# Altium project foxbms2-master.PrjPcb (part 2 of 8)

## Sheet connectors-external.SchDoc
size A3; DocumentNumber: 11; SheetNumber: 11; SheetTotal: 45; SheetDescription: Connectors (external)
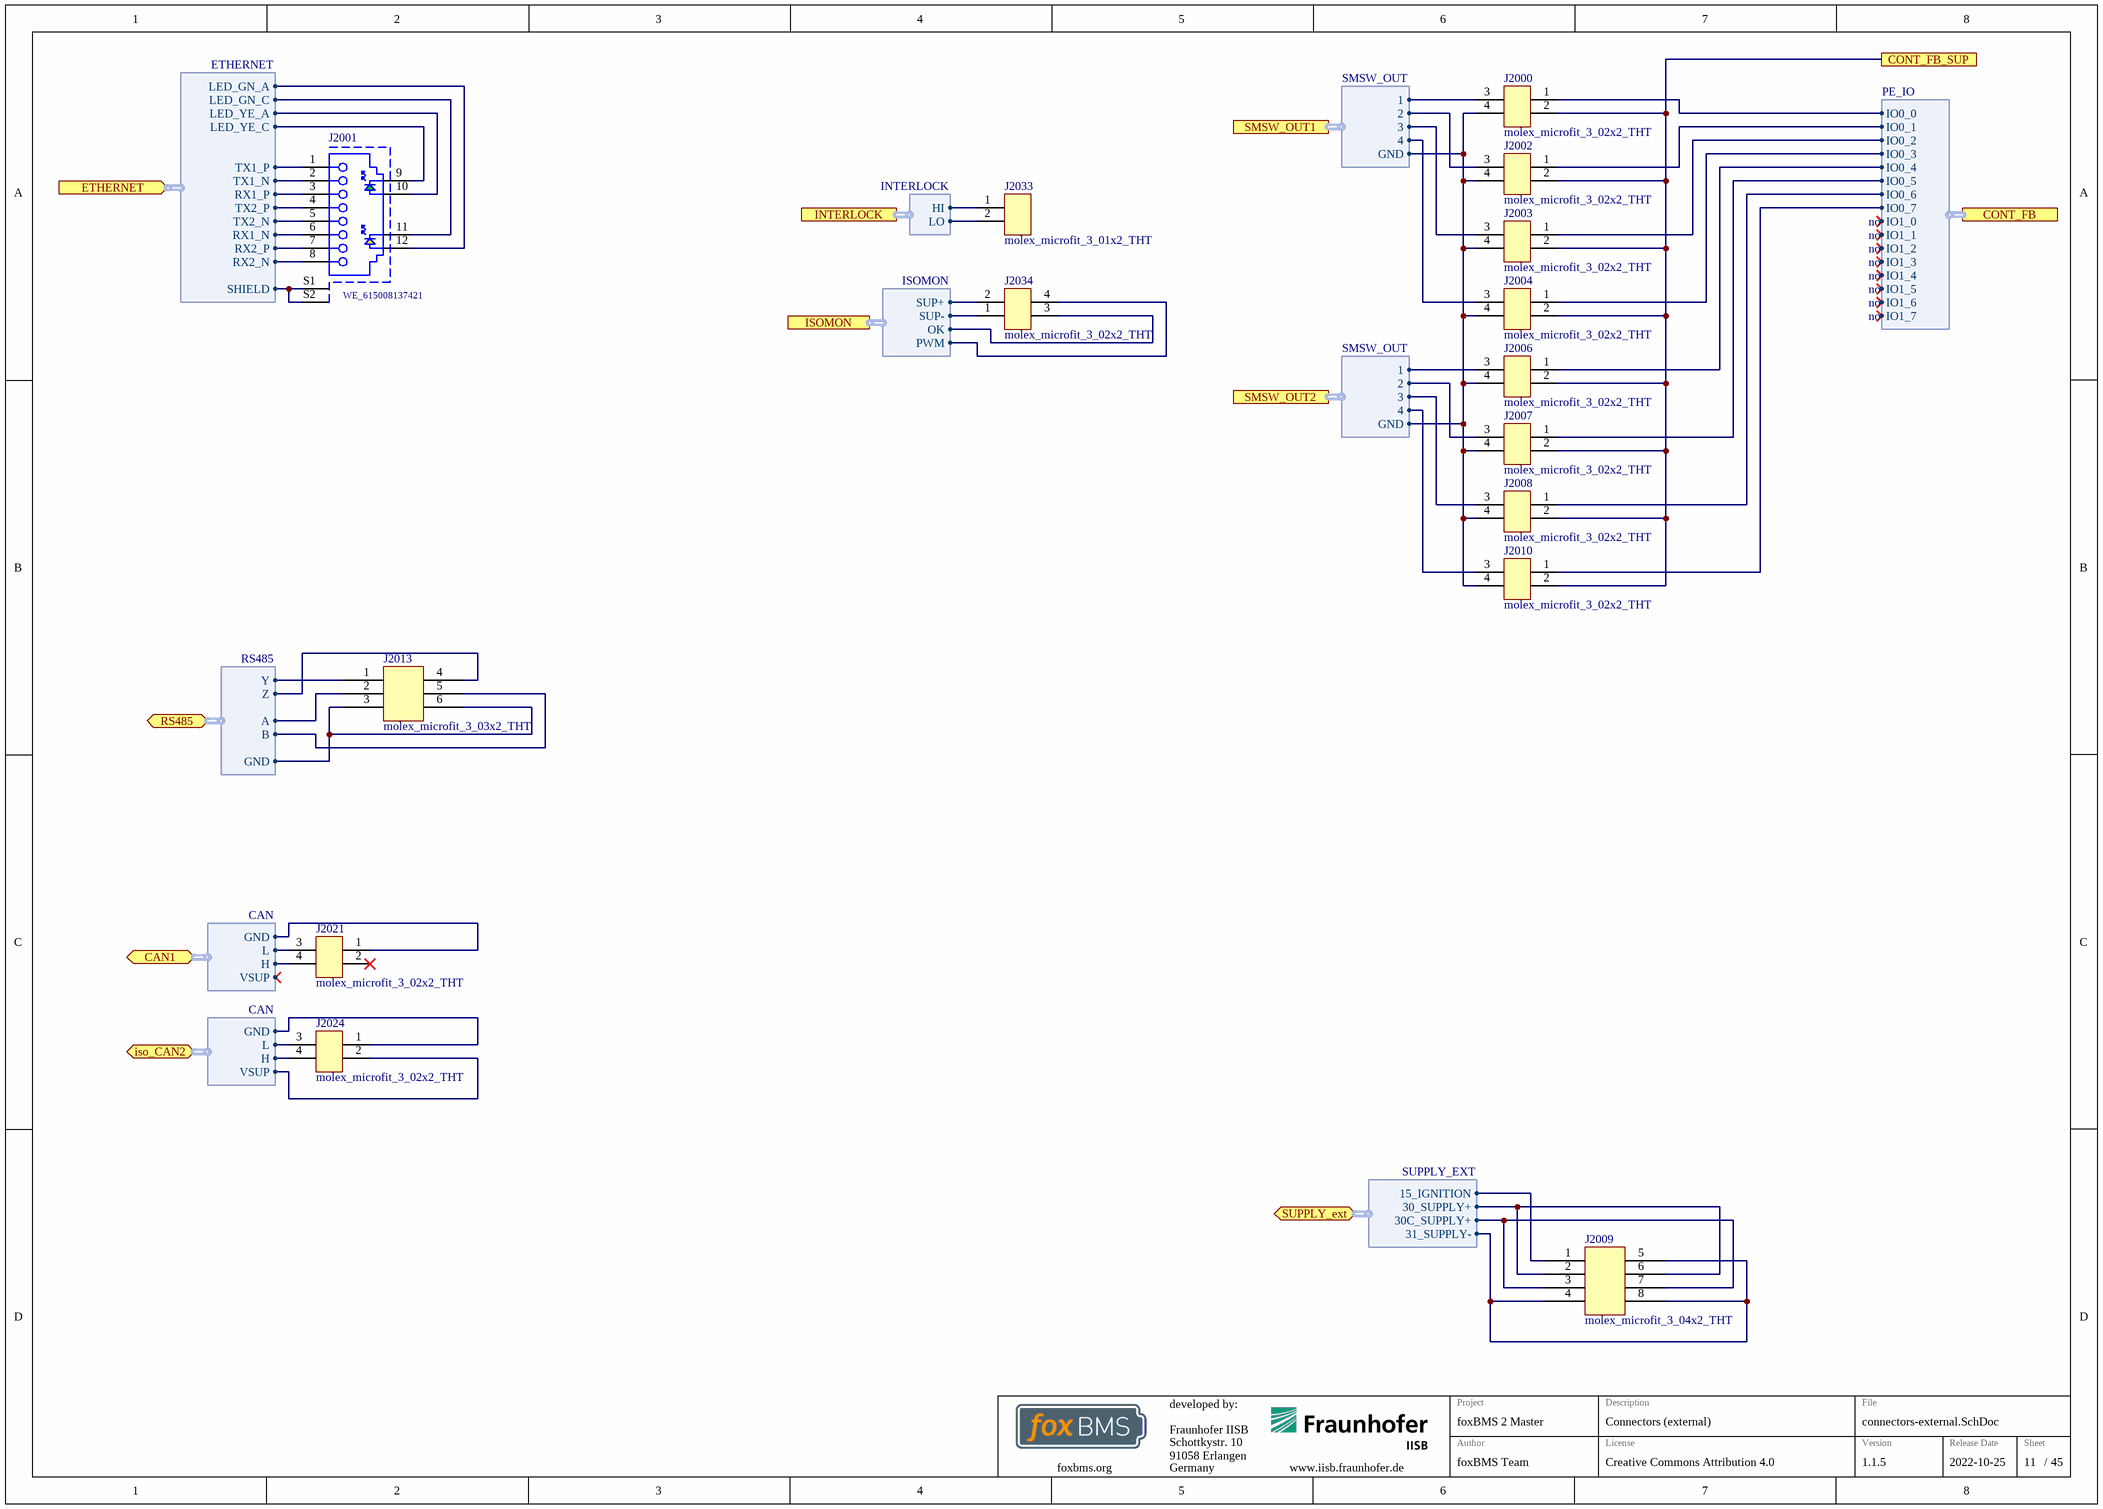
[diagram p7: connectors-external.SchDoc]

### Parts
J2000  molex_microfit_3_02x2_THT  [MOLEX_MICROFIT_02x2_THT]
J2001  WE_615008137421  [WE_615008137421]
J2002  molex_microfit_3_02x2_THT  [MOLEX_MICROFIT_02x2_THT]
J2003  molex_microfit_3_02x2_THT  [MOLEX_MICROFIT_02x2_THT]
J2004  molex_microfit_3_02x2_THT  [MOLEX_MICROFIT_02x2_THT]
J2006  molex_microfit_3_02x2_THT  [MOLEX_MICROFIT_02x2_THT]
J2007  molex_microfit_3_02x2_THT  [MOLEX_MICROFIT_02x2_THT]
J2008  molex_microfit_3_02x2_THT  [MOLEX_MICROFIT_02x2_THT]
J2009  molex_microfit_3_04x2_THT  [MOLEX_MICROFIT_04x2_THT]
J2010  molex_microfit_3_02x2_THT  [MOLEX_MICROFIT_02x2_THT]
J2013  molex_microfit_3_03x2_THT  [MOLEX_MICROFIT_03x2_THT]
J2021  molex_microfit_3_02x2_THT  [MOLEX_MICROFIT_02x2_THT]
J2024  molex_microfit_3_02x2_THT  [MOLEX_MICROFIT_02x2_THT]
J2033  molex_microfit_3_01x2_THT  [MOLEX_MICROFIT_01x2_THT]
J2034  molex_microfit_3_02x2_THT  [MOLEX_MICROFIT_02x2_THT]

### Ports
CAN1 (bidir, harness CAN), CONT_FB (harness PE_IO), CONT_FB_SUP, ETHERNET (in, harness ETHERNET), INTERLOCK (harness INTERLOCK), iso_CAN2 (bidir, harness CAN), ISOMON (harness ISOMON), RS485 (bidir, harness RS485), SMSW_OUT1 (harness SMSW_OUT), SMSW_OUT2 (harness SMSW_OUT), SUPPLY_ext (bidir, harness SUPPLY_EXT)

### Harnesses
RS485: Y, Z, A, B, GND
SMSW_OUT: 1, 2, 3, 4, GND
PE_IO: IO0_0, IO0_1, IO0_2, IO0_3, IO0_4, IO0_5, IO0_6, IO0_7, IO1_0, IO1_1, IO1_2, IO1_3, IO1_4, IO1_5, IO1_6, IO1_7
ISOMON: SUP+, SUP-, OK, PWM
CAN: H, L, GND, VSUP
INTERLOCK: HI, LO
ETHERNET: TX1_P, TX1_N, RX1_P, TX2_P, TX2_N, RX1_N, RX2_P, RX2_N, SHIELD, LED_YE_C, LED_YE_A, LED_GN_C, LED_GN_A
SUPPLY_EXT: 30_SUPPLY+, 31_SUPPLY-, 15_IGNITION, 30C_SUPPLY+

### Nets
GND: J2000.4 J2002.4 J2003.4 J2004.4 J2006.4 J2007.4 J2008.4 J2009.4 J2009.5 J2009.8 J2010.4 J2013.3 J2013.6 J2021.1 ; port RS485.GND, port SMSW_OUT1.GND, port SMSW_OUT2.GND, port CAN1.GND, port SUPPLY_ext.31_SUPPLY-
GND_ext: J2024.1 ; port iso_CAN2.GND
VBB_12V: J2000.2 J2002.2 J2003.2 J2004.2 J2006.2 J2007.2 J2008.2 J2010.2 J2034.2 ; port CONT_FB_SUP, port ISOMON.SUP+
VSUP_ext: J2009.2 J2009.6 ; port SUPPLY_ext.30_SUPPLY+
VSUP_ext: J2009.3 J2009.7 ; port SUPPLY_ext.30C_SUPPLY+  [a separate net that carries the same name]
CAN1.H: J2021.4 ; port CAN1.H
CAN1.L: J2021.3 ; port CAN1.L
CONT_FB.IO0_0: J2000.1 ; port CONT_FB.IO0_0
CONT_FB.IO0_1: J2002.1 ; port CONT_FB.IO0_1
CONT_FB.IO0_2: J2003.1 ; port CONT_FB.IO0_2
CONT_FB.IO0_3: J2004.1 ; port CONT_FB.IO0_3
CONT_FB.IO0_4: J2006.1 ; port CONT_FB.IO0_4
CONT_FB.IO0_5: J2007.1 ; port CONT_FB.IO0_5
CONT_FB.IO0_6: J2008.1 ; port CONT_FB.IO0_6
CONT_FB.IO0_7: J2010.1 ; port CONT_FB.IO0_7
ETHERNET.LED_GN_A: J2001.12 ; port ETHERNET.LED_GN_A
ETHERNET.LED_GN_C: J2001.11 ; port ETHERNET.LED_GN_C
ETHERNET.LED_YE_A: J2001.10 ; port ETHERNET.LED_YE_A
ETHERNET.LED_YE_C: J2001.9 ; port ETHERNET.LED_YE_C
ETHERNET.RX1_N: J2001.6 ; port ETHERNET.RX1_N
ETHERNET.RX1_P: J2001.3 ; port ETHERNET.RX1_P
ETHERNET.RX2_N: J2001.8 ; port ETHERNET.RX2_N
ETHERNET.RX2_P: J2001.7 ; port ETHERNET.RX2_P
ETHERNET.SHIELD: J2001.S1 J2001.S2 ; port ETHERNET.SHIELD
ETHERNET.TX1_N: J2001.2 ; port ETHERNET.TX1_N
ETHERNET.TX1_P: J2001.1 ; port ETHERNET.TX1_P
ETHERNET.TX2_N: J2001.5 ; port ETHERNET.TX2_N
ETHERNET.TX2_P: J2001.4 ; port ETHERNET.TX2_P
INTERLOCK.HI: J2033.1 ; port INTERLOCK.HI
INTERLOCK.LO: J2033.2 ; port INTERLOCK.LO
iso_CAN2.H: J2024.4 ; port iso_CAN2.H
iso_CAN2.L: J2024.3 ; port iso_CAN2.L
iso_CAN2.VSUP: J2024.2 ; port iso_CAN2.VSUP
ISOMON.OK: J2034.3 ; port ISOMON.OK
ISOMON.PWM: J2034.4 ; port ISOMON.PWM
ISOMON.SUP-: J2034.1 ; port ISOMON.SUP-
RS485.A: J2013.2 ; port RS485.A
RS485.B: J2013.5 ; port RS485.B
RS485.Y: J2013.1 ; port RS485.Y
RS485.Z: J2013.4 ; port RS485.Z
SMSW_OUT1.1: J2000.3 ; port SMSW_OUT1.1
SMSW_OUT1.2: J2002.3 ; port SMSW_OUT1.2
SMSW_OUT1.3: J2003.3 ; port SMSW_OUT1.3
SMSW_OUT1.4: J2004.3 ; port SMSW_OUT1.4
SMSW_OUT2.1: J2006.3 ; port SMSW_OUT2.1
SMSW_OUT2.2: J2007.3 ; port SMSW_OUT2.2
SMSW_OUT2.3: J2008.3 ; port SMSW_OUT2.3
SMSW_OUT2.4: J2010.3 ; port SMSW_OUT2.4
SUPPLY_ext.15_IGNITION: J2009.1 ; port SUPPLY_ext.15_IGNITION

Not connected (* = marked no-connect by the designer): J2021 2*

### Notes on the sheet
- not used
- Fraunhofer IISB
- Schottkystr. 10
- developed by:
- 91058 Erlangen
- Germany
- Author
- Project
- License
- Description
- File
- Version
- Release Date
- Sheet
- foxbms.org <https://foxbms.org>
- www.iisb.fraunhofer.de <https://www.iisb.fraunhofer.de/>
- foxBMS Team
- /

### Library data of the parts
J2000 J2002-J2004 J2006-J2008 J2010 J2021 J2024 J2034 = molex_microfit_3_02x2_THT: Micro-Fit 3.0 Right Angle Header, 3.00mm Pitch, Dual Row, 4 Circuits, with Snap-in Plastic Peg PCB Lock, Tin, Glow Wire Capable, Black, 43045-0400; Manufacturer: Molex; Circuits: 4; Rated Voltage: 600V; Rated Current: 8.5A; Automotive Qualified: False; Part Number: molex_microfit_3_02x2_THT; Part Name: MicroFit; Operating Temperature: -40°C - +105°C; Supplier 1: Farnell; Supplier Part Number 1: 9733019; ECCN: EAR99
J2001 = WE_615008137421: Modular Jack WR-MJ, Tab Up; Manufacturer: Würth; Pin Number: 8P8C; Port: 1x1; Entrance: Horizontal; Compliance: Lead free / RoHS; Rated Current: 1.5 A; Working Voltage: 125 VAC; Withstanding Voltage: 1000 VAC; Contact Resistance: 30 mOhm; Circuits: 12; Rated Voltage: 120V AC; Automotive Qualified: False; ComponentLink1Description: Datasheet; ComponentLink1URL: https://www.we-online.com/katalog/datasheet/615008137421.pdf; ComponentLink2Description: Datasheet; ComponentLink2URL: https://katalog.we-online.de/em/datasheet/615008185121.pdf; Part Number: WE_615008137421; Published Date: July 2018; Publisher: Wurth Elektronik; Operating Temperature: −40 °C - +85 °C; Mounting Technology: THT; Packaging: Tray; Part Name: WE_615008137421; Supplier 1: Mouser; Supplier Part Number 1: 710-615008137421; Supplier 3: Wuerth Electronics; Supplier Part Number 3: 615008137421; ECCN: EAR99
J2009 = molex_microfit_3_04x2_THT: Micro-Fit 3.0 Right Angle Header, 3.00mm Pitch, Dual Row, 8 Circuits, with Snap-in Plastic Peg PCB Lock, Tin, Glow Wire Capable, Black, 43045-0800; Manufacturer: Molex; Circuits: 8; Rated Voltage: 600V; Rated Current: 8.5A; Automotive Qualified: False; Part Number: molex_microfit_3_04x2_THT; Part Name: MicroFit; Operating Temperature: -40°C - +105°C; Supplier 1: Farnell; Supplier Part Number 1: 1012254; ECCN: EAR99
J2013 = molex_microfit_3_03x2_THT: Micro-Fit 3.0 Right Angle Header, 3.00mm Pitch, Dual Row, 6 Circuits, with Snap-in Plastic Peg PCB Lock, Tin, Glow Wire Capable, Black, 43045-0600; Manufacturer: Molex; Circuits: 6; Rated Voltage: 600V; Rated Current: 8.5A; Automotive Qualified: False; Part Number: molex_microfit_3_03x2_THT; Part Name: MicroFit; Operating Temperature: -40°C - +105°C; Supplier 1: Farnell; Supplier Part Number 1: 1012252; ECCN: EAR99
J2033 = molex_microfit_3_01x2_THT: Micro-Fit 3.0 Right Angle Header, 3.00mm Pitch, Dual Row, 2 Circuits, with Snap-in Plastic Peg PCB Lock, Tin, Glow Wire Capable, Black, 43045-0200; Manufacturer: Molex; Circuits: 2; Rated Voltage: 600V; Rated Current: 8.5A; Automotive Qualified: False; Part Number: molex_microfit_3_01x2_THT; Part Name: MicroFit; Operating Temperature: -40°C - +105°C; Supplier 1: Farnell; Supplier Part Number 1: 1012251; ECCN: EAR99

## Sheet connectors-internal.SchDoc
size A3; DocumentNumber: 13; SheetNumber: 13; SheetTotal: 45; SheetDescription: Connectors (internal)
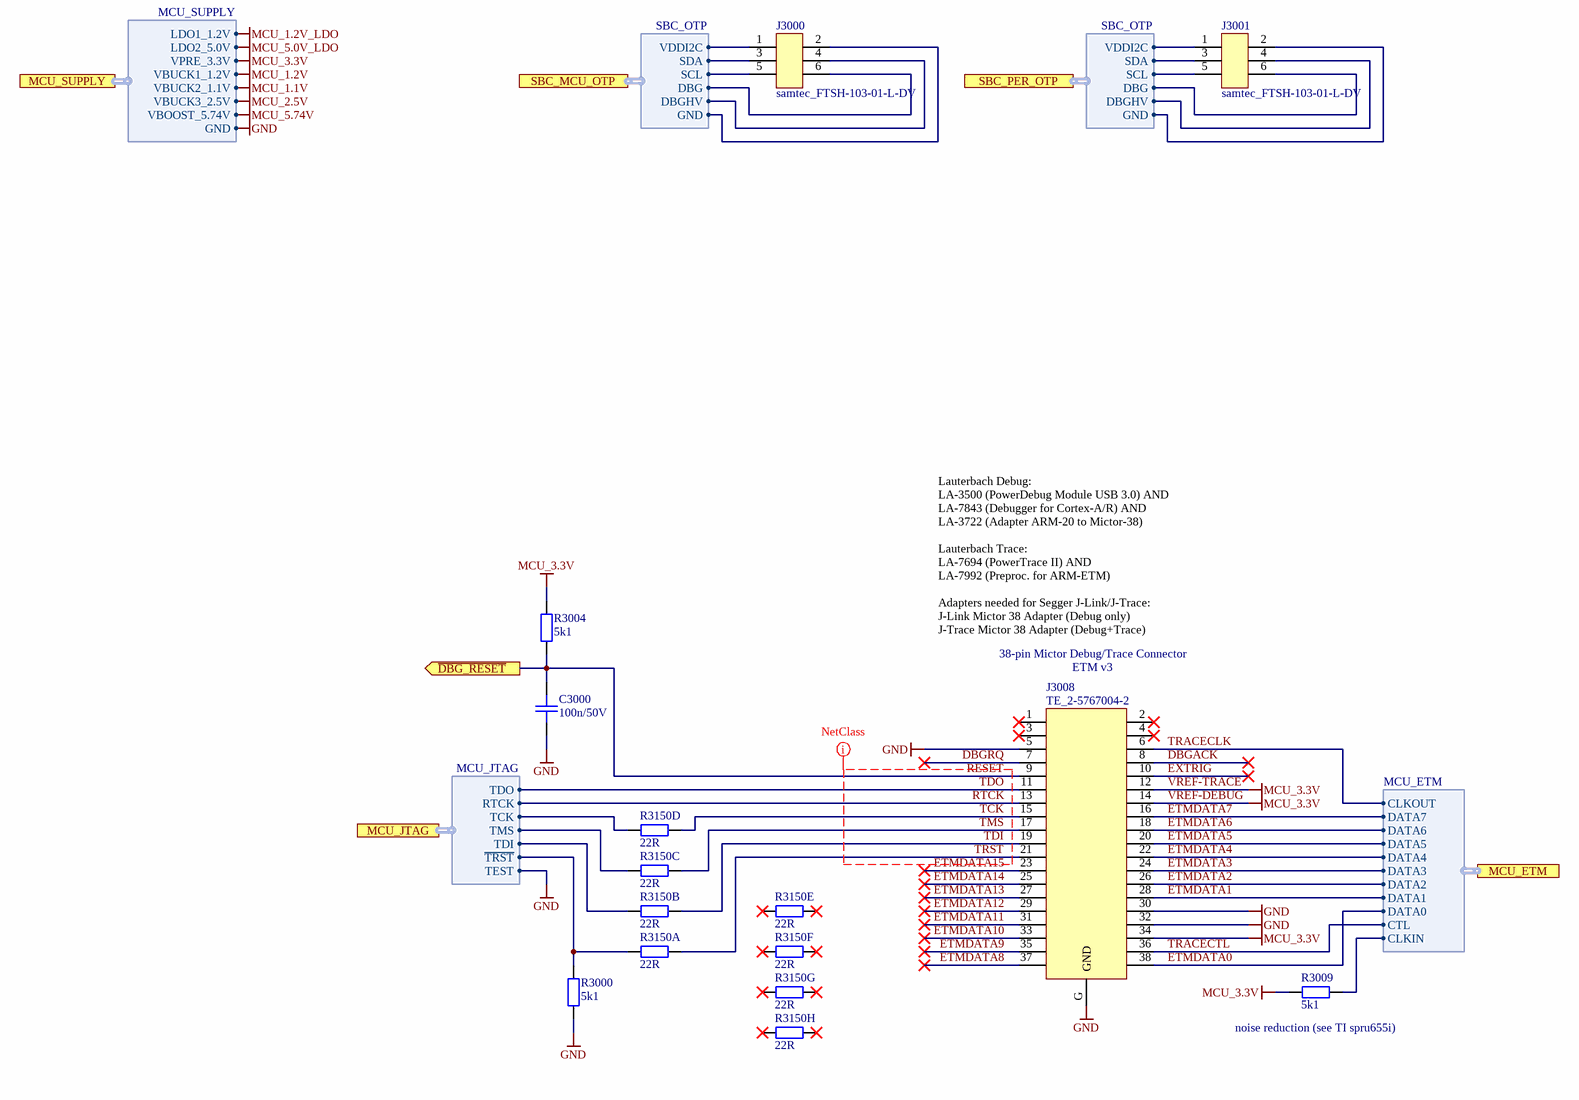
[diagram p8: connectors-internal.SchDoc]

### Parts
C3000  100n/50V  [CAPC1005X06N]
J3000  samtec_FTSH-103-01-L-DV  [SAMTEC_FTSH-103-01-L-DV]
J3001  samtec_FTSH-103-01-L-DV  [SAMTEC_FTSH-103-01-L-DV]
J3008  TE_2-5767004-2  [TE_2-5767004-2]
R3000  5k1  [RESC1005X04N]
R3004  5k1  [RESC1005X04N]
R3009  5k1  [RESC1005X04N]
R3150  22R  [PANASONIC_EXB2HV]  (parts A,B,C,D,E,F,G,H of 8)

### Ports
MCU_ETM (harness MCU_ETM), MCU_JTAG (harness MCU_JTAG), MCU_SUPPLY (harness MCU_SUPPLY), SBC_MCU_OTP (harness SBC_OTP), SBC_PER_OTP (harness SBC_OTP), ~{DBG_RESET} (out)

### Harnesses
SBC_OTP: VDDI2C, SDA, SCL, GND, DBG, DBGHV
MCU_SUPPLY: VBUCK1_1.2V, VBUCK2_1.1V, VBUCK3_2.5V, LDO1_1.2V, LDO2_5.0V, GND, VPRE_3.3V, VBOOST_5.74V
MCU_ETM: CLKOUT, CTL, CLKIN, DATA0, DATA1, DATA2, DATA3, DATA4, DATA5, DATA6, DATA7
MCU_JTAG: ~{TRST}, RTCK, TCK, TDI, TDO, TMS, TEST

### Nets
GND: C3000.1 J3000.2 J3001.2 J3008.5 J3008.30 J3008.32 J3008.G(GND) R3000.1 ; port SBC_MCU_OTP.GND, port SBC_PER_OTP.GND, port MCU_SUPPLY.GND, port MCU_JTAG.TEST
MCU_3.3V: J3000.1 J3008.12 J3008.14 J3008.34 R3004.2 R3009.2 ; port SBC_MCU_OTP.VDDI2C, port MCU_SUPPLY.VPRE_3.3V  [also labelled VREF-DEBUG, VREF-TRACE]
PER_3.3V: J3001.1 ; port SBC_PER_OTP.VDDI2C
~{RESET}: C3000.2 J3008.9 R3004.1 ; port ~{DBG_RESET}  [project net ~{DBG_RESET}]
~{TRST}: J3008.21 R3150.16  [project net ~{TRST_13}]
DBGACK: J3008.8  [project net DBGACK_13]
DBGRQ: J3008.7  [project net DBGRQ_13]
ETMDATA0: J3008.38 ; port MCU_ETM.DATA0  [project net MCU_ETM.DATA0]
ETMDATA1: J3008.28 ; port MCU_ETM.DATA1  [project net MCU_ETM.DATA1]
ETMDATA2: J3008.26 ; port MCU_ETM.DATA2  [project net MCU_ETM.DATA2]
ETMDATA3: J3008.24 ; port MCU_ETM.DATA3  [project net MCU_ETM.DATA3]
ETMDATA4: J3008.22 ; port MCU_ETM.DATA4  [project net MCU_ETM.DATA4]
ETMDATA5: J3008.20 ; port MCU_ETM.DATA5  [project net MCU_ETM.DATA5]
ETMDATA6: J3008.18 ; port MCU_ETM.DATA6  [project net MCU_ETM.DATA6]
ETMDATA7: J3008.16 ; port MCU_ETM.DATA7  [project net MCU_ETM.DATA7]
ETMDATA8: J3008.37  [project net ETMDATA8_13]
ETMDATA9: J3008.35  [project net ETMDATA9_13]
ETMDATA10: J3008.33  [project net ETMDATA10_13]
ETMDATA11: J3008.31  [project net ETMDATA11_13]
ETMDATA12: J3008.29  [project net ETMDATA12_13]
ETMDATA13: J3008.27  [project net ETMDATA13_13]
ETMDATA14: J3008.25  [project net ETMDATA14_13]
ETMDATA15: J3008.23  [project net ETMDATA15_13]
EXTRIG: J3008.10  [project net EXTRIG_13]
MCU_ETM.CLKIN: R3009.1 ; port MCU_ETM.CLKIN
MCU_JTAG~{.}TRST: R3000.2 R3150.1 ; port MCU_JTAG.~{TRST}
MCU_JTAG.TCK: R3150.4 ; port MCU_JTAG.TCK
MCU_JTAG.TDI: R3150.2 ; port MCU_JTAG.TDI
MCU_JTAG.TMS: R3150.3 ; port MCU_JTAG.TMS
RTCK: J3008.13 ; port MCU_JTAG.RTCK  [project net MCU_JTAG.RTCK]
SBC_MCU_OTP.DBG: J3000.6 ; port SBC_MCU_OTP.DBG
SBC_MCU_OTP.DBGHV: J3000.4 ; port SBC_MCU_OTP.DBGHV
SBC_MCU_OTP.SCL: J3000.5 ; port SBC_MCU_OTP.SCL
SBC_MCU_OTP.SDA: J3000.3 ; port SBC_MCU_OTP.SDA
SBC_PER_OTP.DBG: J3001.6 ; port SBC_PER_OTP.DBG
SBC_PER_OTP.DBGHV: J3001.4 ; port SBC_PER_OTP.DBGHV
SBC_PER_OTP.SCL: J3001.5 ; port SBC_PER_OTP.SCL
SBC_PER_OTP.SDA: J3001.3 ; port SBC_PER_OTP.SDA
TCK: J3008.15 R3150.13  [project net TCK_13]
TDI: J3008.19 R3150.15  [project net TDI_13]
TDO: J3008.11 ; port MCU_JTAG.TDO  [project net MCU_JTAG.TDO]
TMS: J3008.17 R3150.14  [project net TMS_13]
TRACECLK: J3008.6 ; port MCU_ETM.CLKOUT  [project net MCU_ETM.CLKOUT]
TRACECTL: J3008.36 ; port MCU_ETM.CTL  [project net MCU_ETM.CTL]

Not connected (* = marked no-connect by the designer): J3008 1* 2* 3* 4*; R3150 5* 6* 7* 8* 9* 10* 11* 12*

### Layout directives
net class MCU_JTAG: RTCK, TCK, TDI, TDO, TMS, ~{RESET}, ~{TRST}

### Notes on the sheet
- Lauterbach Debug:
  LA-3500 (PowerDebug Module USB 3.0) AND
  LA-7843 (Debugger for Cortex-A/R) AND
  LA-3722	(Adapter ARM-20 to Mictor-38)
  Lauterbach Trace:
  LA-7694 (PowerTrace II) AND
  LA-7992 (Preproc. for ARM-ETM)
  Adapters needed for Segger J-Link/J-Trace:
  J-Link Mictor 38 Adapter (Debug only)
  J-Trace Mictor 38 Adapter (Debug+Trace)
- 38-pin Mictor Debug/Trace Connector
- (near J3008) ETM v3
- (near R3009) noise reduction (see TI spru655i)
- Fraunhofer IISB
- Schottkystr. 10
- developed by:
- 91058 Erlangen
- Germany
- Author
- Project
- License
- Description
- File
- Version
- Release Date
- Sheet
- foxbms.org <https://foxbms.org>
- www.iisb.fraunhofer.de <https://www.iisb.fraunhofer.de/>
- foxBMS Team
- /

### Library data of the parts
C3000 = gen_C_ceramic_100n_50V_X7R_0402: MLCC; Capacitance: 100n; Rated Voltage: 50V; Dielectric: X7R; Case EIA: 0402; Case Metric: 1005; PnP Package: 0402C; PnP Value: 100nF/50V/X7R; PnP equipped: x; Automotive Qualified: True; AEC-Q Norm: AEC-Q200; Part Number: gen_C_ceramic_100n_50V_X7R_0402; Supplier 1: Farnell; Supplier Part Number 1: 2210822; ECCN: EAR99
J3000 J3001 = samtec_FTSH-103-01-L-DV: Board-To-Board Connector, 6pin, 1.27mm; Manufacturer: Samtec; Circuits: 6; Rated Current: 3.4A; Automotive Qualified: False; Part Number: samtec_FTSH-103-01-L-DV; Part Name: FTSH-103-01-L-DV; Operating Temperature: -55°C - +125°C; ComponentLink1Description: Datasheet; ComponentLink1URL: http://www.farnell.com/datasheets/1992056.pdf; Supplier 1: Farnell; Supplier Part Number 1: 2415840; Supplier 2: Mouser; Supplier Part Number 2: 200-FTSH10301LDVTR; Supplier 3: Digikey; Supplier Part Number 3: SAM13920CT-ND
J3008 = TE_2-5767004-2: Connector, SMT, 38 POS, MICTOR; Manufacturer: TE; Circuits: 38; Rated Voltage: 30V AC; Rated Current: 11.5A; Automotive Qualified: False; Part Number: TE_2-5767004-2; Part Name: TE_2-5767004-2; Operating Temperature: −55 °C - +125 °C; ComponentLink1Description: Datasheet; ComponentLink1URL: https://www.te.com/deu-de/product-2-5767004-2.datasheet.pdf; Supplier 1: Mouser; Supplier Part Number 1: 571-2-5767004-2; Supplier 2: Farnell; Supplier Part Number 2: 1076633; Supplier 3: Digikey; Supplier Part Number 3: A32308-ND; ECCN: EAR99
R3000 R3004 R3009 = gen_R_5k1_0402: SMD Resistor 5k1 0402; Tolerance: 1%; Power: 0.063W; Case EIA: 0402; Case Metric: 1005; Maximum Working Voltage: 50V; PnP Package: 0402R; Automotive Qualified: True; PnP equipped: x; AEC-Q Norm: AEC-Q200; AEC-Q Grade: Grade 0; Part Number: gen_R_5k1_0402; Operating Temperature: -55°C - +155°C; Resistance: 5k1; Series: E24; PnP Value: 5k1; Supplier 1: Farnell; Supplier Part Number 1: 2302709; ECCN: EAR99
R3150 = EXB2HV220JV: SMD Resistor Array 0402 8x; Tolerance: 5%; Power: 63mW; Case EIA: EXB2HV; Maximum Working Voltage: 25V; Automotive Qualified: True; AEC-Q Norm: AEC-Q200; AEC-Q Grade: Grade 1; Part Number: EXB2HV220JV; Operating Temperature: -55°C - +155°C; Resistance: 22R; Series: E24, E96; Supplier 1: Farnell; Supplier Part Number 1: 2060065; Supplier 2: Mouser; Supplier Part Number 2: 667-EXB-2HV220JV; ECCN: EAR99

## Sheet communication.SchDoc
size A3; DocumentNumber: 2; SheetNumber: 2; SheetTotal: 45; SheetDescription: Communication
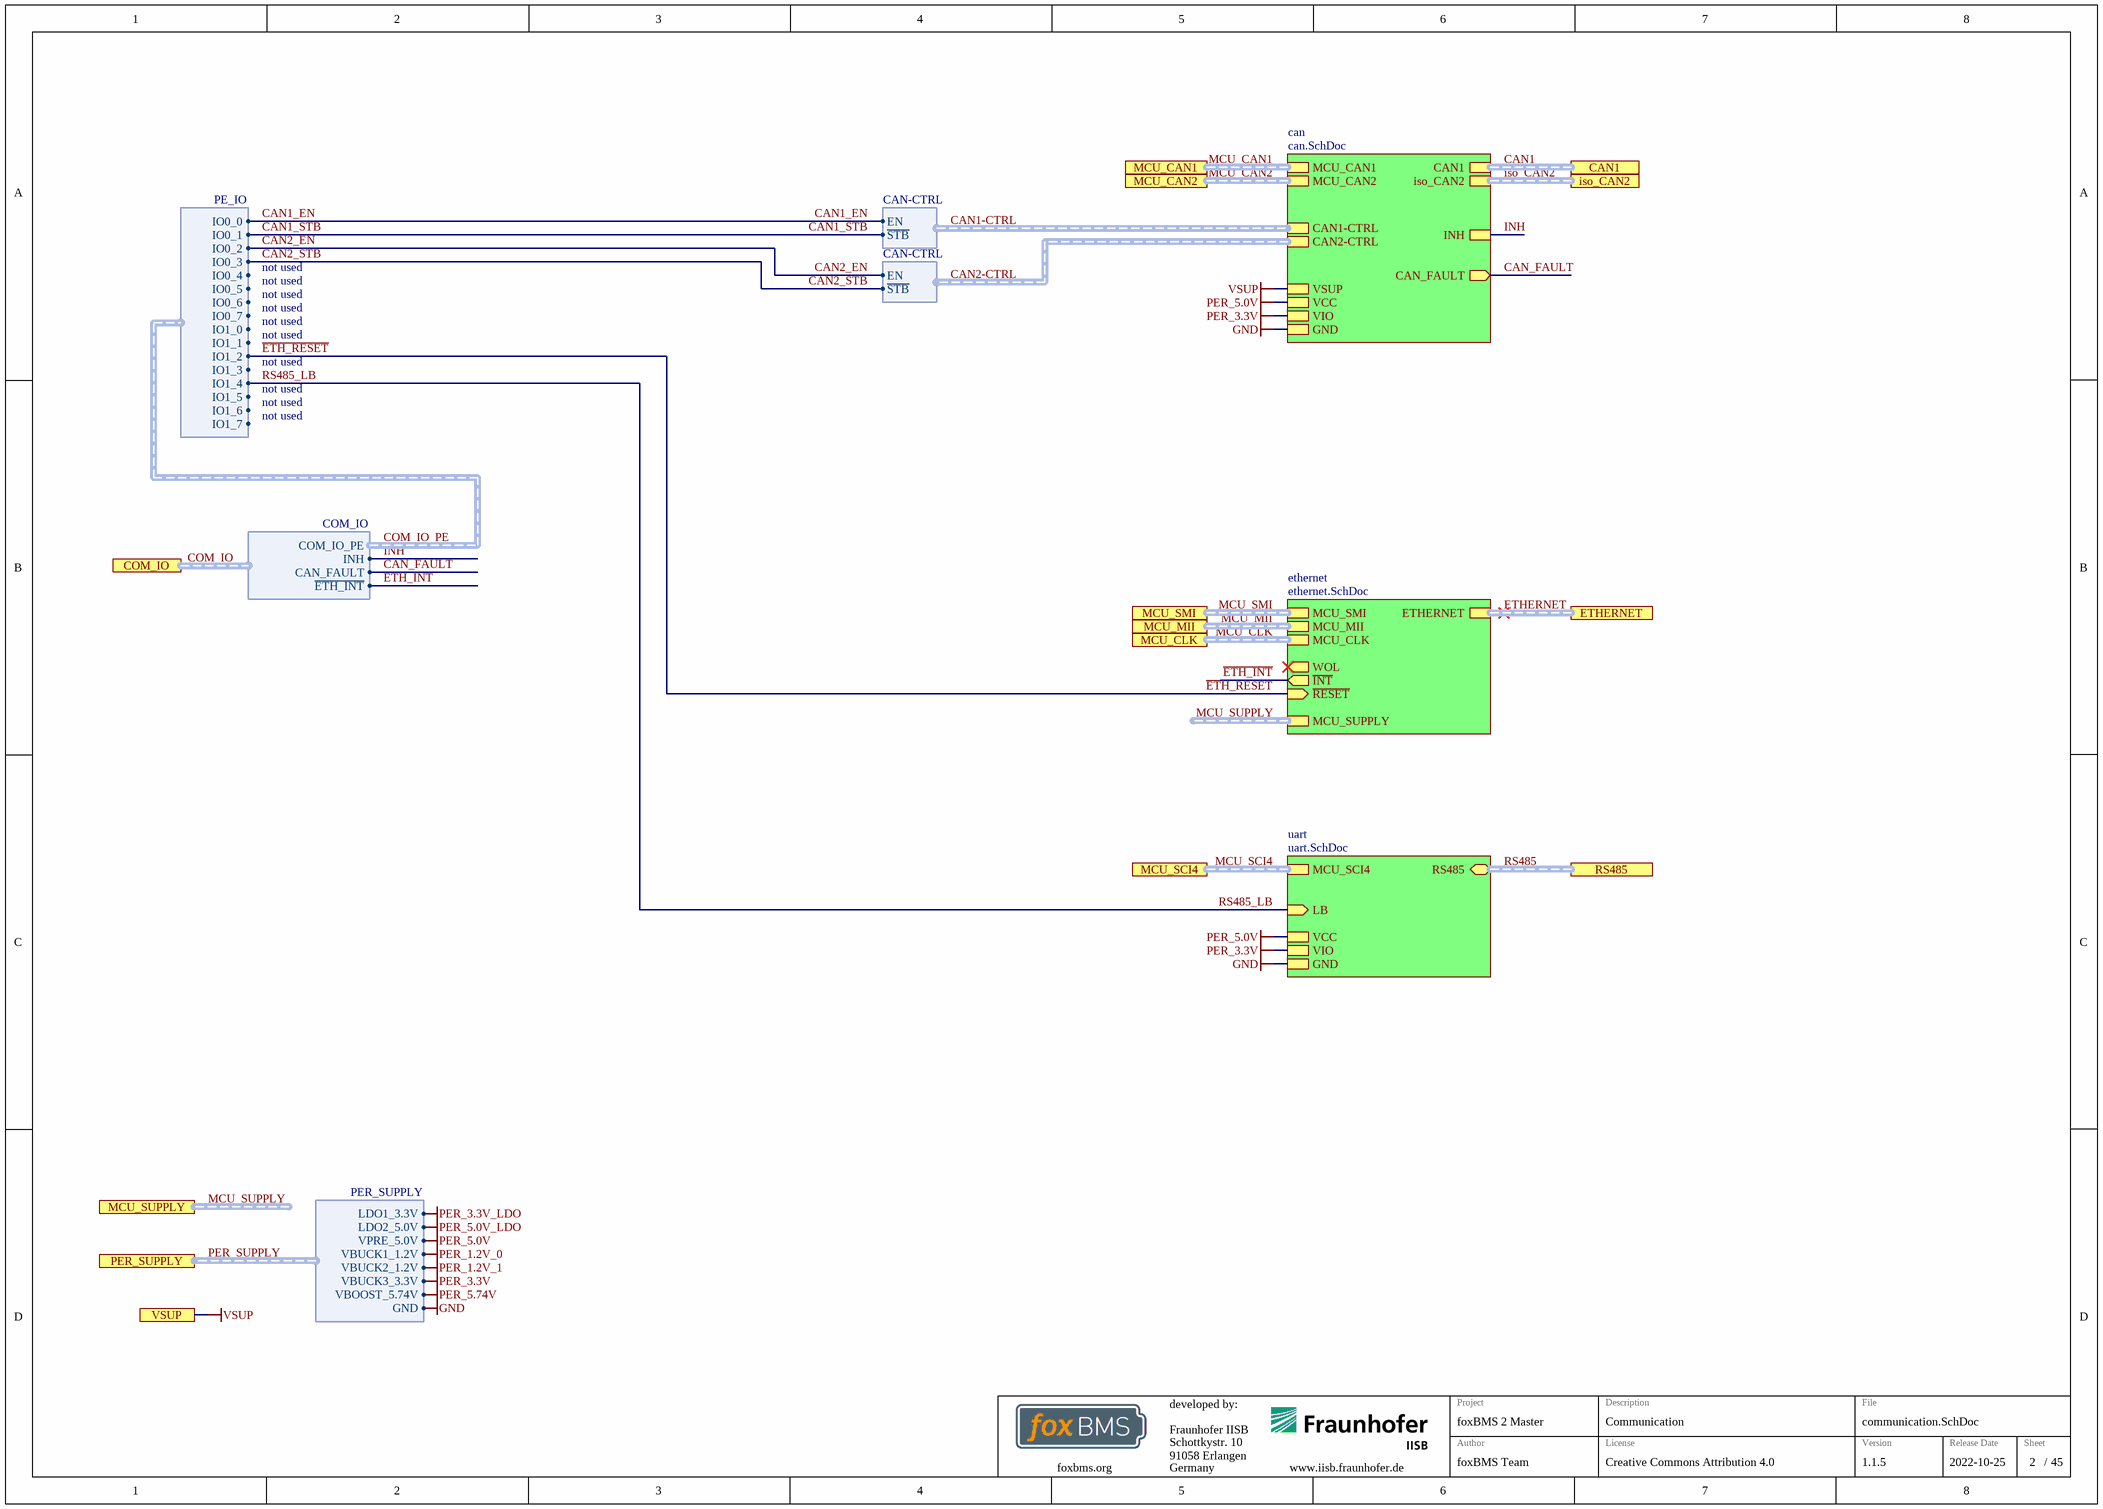
[diagram p9: communication.SchDoc]

### Sub-sheets
can = can.SchDoc: MCU_CAN1 (harness MCU_CAN), CAN2-CTRL (harness CAN-CTRL), CAN1-CTRL (harness CAN-CTRL), MCU_CAN2 (harness MCU_CAN), iso_CAN2 (harness CAN), CAN1 (harness CAN), VCC, GND, VSUP, INH, CAN_FAULT (out), VIO
ethernet = ethernet.SchDoc: MCU_SMI (harness MCU_SMI), WOL (out), MCU_MII (harness MCU_MII), ~{INT} (out), ~{RESET} (in), ETHERNET (harness ETHERNET), MCU_SUPPLY (harness MCU_SUPPLY), MCU_CLK (harness CLOCK)
uart = uart.SchDoc: MCU_SCI4 (harness MCU_SCI), LB (in), VIO, RS485 (bidir, harness RS485), VCC, GND

### Ports
CAN1 (harness CAN), COM_IO (harness COM_IO), ETHERNET (harness ETHERNET), iso_CAN2 (harness CAN), MCU_CAN1 (harness MCU_CAN), MCU_CAN2 (harness MCU_CAN), MCU_CLK (harness CLOCK), MCU_MII (harness MCU_MII), MCU_SCI4 (harness MCU_SCI), MCU_SMI (harness MCU_SMI), MCU_SUPPLY (harness MCU_SUPPLY), PER_SUPPLY (harness PER_SUPPLY), RS485 (harness RS485), VSUP

### Harnesses
PE_IO: IO0_0, IO0_1, IO0_2, IO0_3, IO0_4, IO0_5, IO0_6, IO0_7, IO1_0, IO1_1, IO1_2, IO1_3, IO1_4, IO1_5, IO1_6, IO1_7
CAN-CTRL: EN, ~{STB}
PER_SUPPLY: GND, VBOOST_5.74V, LDO1_3.3V, LDO2_5.0V, VPRE_5.0V, VBUCK1_1.2V, VBUCK2_1.2V, VBUCK3_3.3V
COM_IO: COM_IO_PE, CAN_FAULT, ~{ETH_INT}, INH

### Nets
GND: sheet can/GND, sheet uart/GND, port PER_SUPPLY.GND
PER_3.3V: sheet can/VIO, sheet uart/VIO, port PER_SUPPLY.VBUCK3_3.3V
PER_5.0V: sheet can/VCC, sheet uart/VCC, port PER_SUPPLY.VPRE_5.0V
VSUP: port VSUP, sheet can/VSUP  [project net VSUP_30]
~{CAN1_STB}: harness PE_IO.IO0_1, sheet can/CAN1-CTRL.~{STB}  [project net CAN1-CTRL~{.}STB]
~{CAN2_STB}: harness PE_IO.IO0_3, sheet can/CAN2-CTRL.~{STB}  [project net CAN2-CTRL~{.}STB]
~{ETH_INT}: sheet ethernet/~{INT}, port COM_IO.~{ETH_INT}  [project net COM_IO~{.}ETH_INT]
~{ETH_RESET}: sheet ethernet/~{RESET}, harness PE_IO.IO1_2  [project net COM_IO_PE.IO1_2]
CAN1_EN: harness PE_IO.IO0_0, sheet can/CAN1-CTRL.EN  [project net CAN1-CTRL.EN]
CAN2_EN: harness PE_IO.IO0_2, sheet can/CAN2-CTRL.EN  [project net CAN2-CTRL.EN]
CAN_FAULT: sheet can/CAN_FAULT, port COM_IO.CAN_FAULT  [project net COM_IO.CAN_FAULT]
INH: sheet can/INH, port COM_IO.INH  [project net COM_IO.INH]
RS485_LB: sheet uart/LB, harness PE_IO.IO1_4  [project net COM_IO_PE.IO1_4]

### Buses and harness runs
harness CAN1 = port CAN1 = sheet can/CAN1
harness CAN1-CTRL = sheet can/CAN1-CTRL
harness CAN2-CTRL = sheet can/CAN2-CTRL
harness COM_IO = port COM_IO
harness ETHERNET = port ETHERNET = sheet ethernet/ETHERNET
harness iso_CAN2 = port iso_CAN2 = sheet can/iso_CAN2
harness MCU_CAN1 = port MCU_CAN1 = sheet can/MCU_CAN1
harness MCU_CAN2 = port MCU_CAN2 = sheet can/MCU_CAN2
harness MCU_CLK = port MCU_CLK = sheet ethernet/MCU_CLK
harness MCU_MII = port MCU_MII = sheet ethernet/MCU_MII
harness MCU_SCI4 = port MCU_SCI4 = sheet uart/MCU_SCI4
harness MCU_SMI = port MCU_SMI = sheet ethernet/MCU_SMI
harness MCU_SUPPLY = port MCU_SUPPLY
harness MCU_SUPPLY = sheet ethernet/MCU_SUPPLY
harness PER_SUPPLY = port PER_SUPPLY
harness RS485 = port RS485 = sheet uart/RS485

### Notes on the sheet
- not used
- Fraunhofer IISB
- Schottkystr. 10
- developed by:
- 91058 Erlangen
- Germany
- Author
- Project
- License
- Description
- File
- Version
- Release Date
- Sheet
- foxbms.org <https://foxbms.org>
- www.iisb.fraunhofer.de <https://www.iisb.fraunhofer.de/>
- foxBMS Team
- /

## Sheet can.SchDoc
size A3; DocumentNumber: 3; SheetNumber: 3; SheetTotal: 45; SheetDescription: CAN Communication
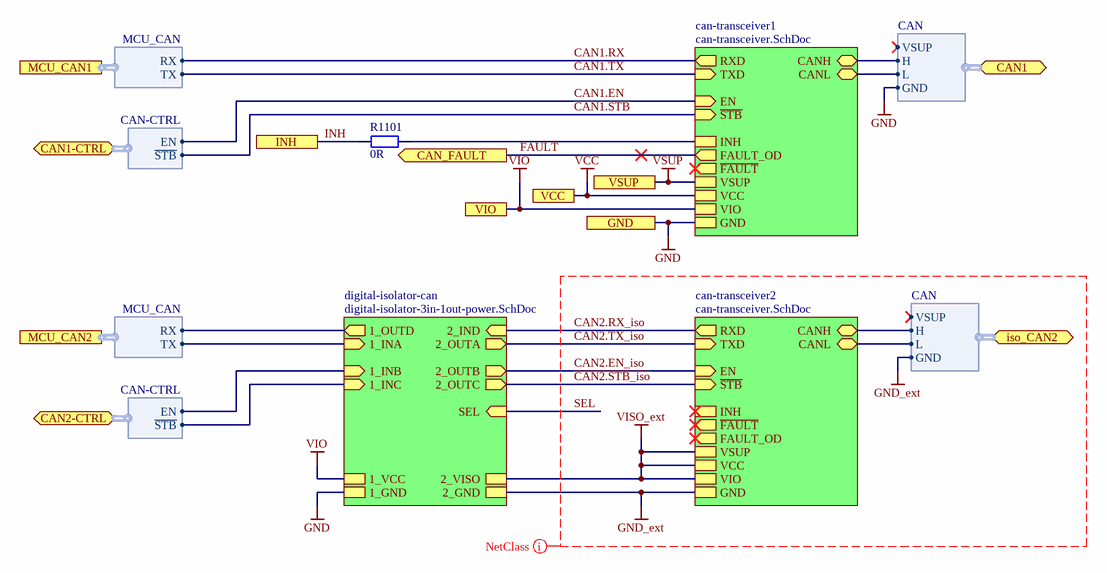
[diagram p10: can.SchDoc]

### Parts
R1101  0R  [RESC1005X04N]

### Sub-sheets
can-transceiver1 = can-transceiver.SchDoc: TXD (in), CANL (bidir), INH, RXD (out), VCC, EN (in), GND, CANH (bidir), VSUP, ~{STB} (in), VIO, ~{FAULT} (out), FAULT_OD (out)
can-transceiver2 = can-transceiver.SchDoc: TXD (in), CANL (bidir), INH, RXD (out), VCC, EN (in), GND, CANH (bidir), VSUP, ~{STB} (in), VIO, FAULT_OD (out), ~{FAULT} (out)
digital-isolator-can = digital-isolator-3in-1out-power.SchDoc: 2_OUTA (out), 1_VCC, 2_OUTB (out), 2_GND, 2_IND (in), 1_INA (in), 1_INB (in), 1_INC (in), 1_GND, 1_OUTD (out), 2_OUTC (out), 2_VISO, SEL (in)

### Ports
CAN1 (bidir, harness CAN), CAN1-CTRL (bidir, harness CAN-CTRL), CAN2-CTRL (bidir, harness CAN-CTRL), CAN_FAULT (out), GND, INH, iso_CAN2 (bidir, harness CAN), MCU_CAN1 (harness MCU_CAN), MCU_CAN2 (harness MCU_CAN), VCC, VIO, VSUP

### Harnesses
CAN: H, L, GND, VSUP
CAN-CTRL: EN, ~{STB}
MCU_CAN: RX, TX

### Nets
GND: port GND, sheet can-transceiver1/GND, sheet digital-isolator-can/1_GND, port CAN1.GND
GND_ext: sheet can-transceiver2/GND, sheet digital-isolator-can/2_GND, port iso_CAN2.GND
VCC: port VCC, sheet can-transceiver1/VCC  [project net PER_5.0V]
VIO: port VIO, sheet can-transceiver1/VIO, sheet digital-isolator-can/1_VCC  [project net PER_3.3V]
VISO_ext: sheet can-transceiver2/VCC, sheet can-transceiver2/VSUP, sheet can-transceiver2/VIO, sheet digital-isolator-can/2_VISO
VSUP: port VSUP, sheet can-transceiver1/VSUP  [project net VSUP_30]
~{CAN1.STB}: sheet can-transceiver1/~{STB}, port CAN1-CTRL.~{STB}  [project net CAN1-CTRL~{.}STB]
~{CAN2.STB_iso}: sheet can-transceiver2/~{STB}, sheet digital-isolator-can/2_OUTC
CAN1.EN: sheet can-transceiver1/EN, port CAN1-CTRL.EN  [project net CAN1-CTRL.EN]
CAN1.H: sheet can-transceiver1/CANH, port CAN1.H
CAN1.L: sheet can-transceiver1/CANL, port CAN1.L
CAN1.RX: sheet can-transceiver1/RXD, port MCU_CAN1.RX  [project net MCU_CAN1.RX]
CAN1.TX: sheet can-transceiver1/TXD, port MCU_CAN1.TX  [project net MCU_CAN1.TX]
CAN2-CTRL~{.}STB: sheet digital-isolator-can/1_INC, port CAN2-CTRL.~{STB}
CAN2-CTRL.EN: sheet digital-isolator-can/1_INB, port CAN2-CTRL.EN
CAN2.EN_iso: sheet can-transceiver2/EN, sheet digital-isolator-can/2_OUTB
CAN2.RX_iso: sheet can-transceiver2/RXD, sheet digital-isolator-can/2_IND
CAN2.TX_iso: sheet can-transceiver2/TXD, sheet digital-isolator-can/2_OUTA
FAULT: port CAN_FAULT, sheet can-transceiver1/FAULT_OD  [project net COM_IO.CAN_FAULT]
INH: R1101.2 ; port INH  [project net COM_IO.INH]
iso_CAN2.H: sheet can-transceiver2/CANH, port iso_CAN2.H
iso_CAN2.L: sheet can-transceiver2/CANL, port iso_CAN2.L
MCU_CAN2.RX: sheet digital-isolator-can/1_OUTD, port MCU_CAN2.RX
MCU_CAN2.TX: sheet digital-isolator-can/1_INA, port MCU_CAN2.TX
NetR1101_1: R1101.1 ; sheet can-transceiver1/INH

### Layout directives
net class iso_CAN2: CAN2.EN_iso, CAN2.RX_iso, CAN2.TX_iso, GND_ext, SEL, VISO_ext, ~{CAN2.STB_iso}

### Notes on the sheet
- Fraunhofer IISB
- Schottkystr. 10
- developed by:
- 91058 Erlangen
- Germany
- Author
- Project
- License
- Description
- File
- Version
- Release Date
- Sheet
- foxbms.org <https://foxbms.org>
- www.iisb.fraunhofer.de <https://www.iisb.fraunhofer.de/>
- foxBMS Team
- /

### Library data of the parts
R1101 = gen_R_0R_0402: SMD Resistor 0R 0402; Power: 0.063W; Case EIA: 0402; Case Metric: 1005; Maximum Working Voltage: 50V; PnP Package: 0402R; Automotive Qualified: True; AEC-Q Norm: AEC-Q200; PnP equipped: x; Part Number: gen_R_0R_0402; Operating Temperature: -55°C - +155°C; Resistance: 0R; Series: Jumper; PnP Value: 0R; Supplier 1: Farnell; Supplier Part Number 1: 1469661; Supplier 2: Farnell; Supplier Part Number 2: 2059190; ECCN: EAR99

## Sheet can-transceiver.SchDoc
size A3; DocumentNumber: 4; SheetNumber: 4; SheetTotal: 45; SheetDescription: CAN Transceiver
Used 2 times, as channels communication/can/can-transceiver1, communication/can/can-transceiver2. Parts and nets are listed once, with the designators drawn on the sheet.
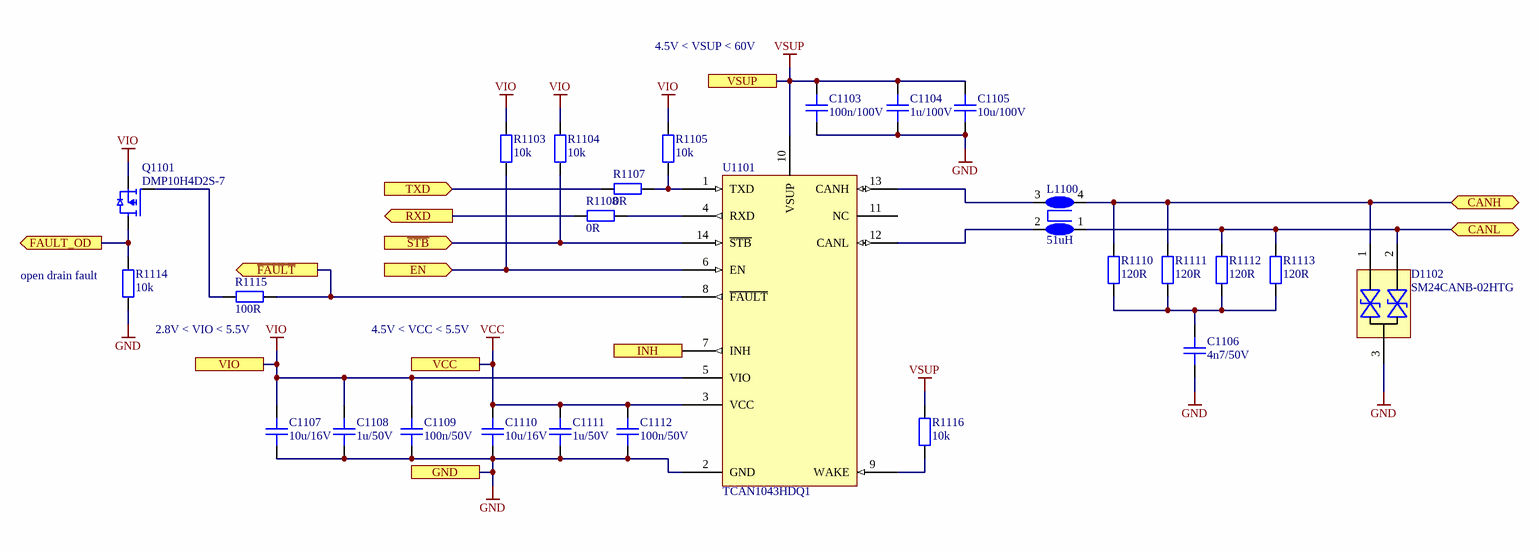
[diagram p11: can-transceiver.SchDoc]

### Parts
C1103  100n/100V  [CAPC1608X08N]
C1104  1u/100V  [CAPC3216X18N]
C1105  10u/100V  [CAPC5750X28N]
C1106  4n7/50V  [CAPC1005X06N]
C1107  10u/16V  [CAPC2012X14N]
C1108  1u/50V  [CAPC1608X08N]
C1109  100n/50V  [CAPC1005X06N]
C1110  10u/16V  [CAPC2012X14N]
C1111  1u/50V  [CAPC1608X08N]
C1112  100n/50V  [CAPC1005X06N]
D1102  SM24CANB-02HTG  [LF_SOT23-3]
L1100  51uH  [MURATA_DLW32SH]
Q1101  DMP10H4D2S-7  [SOT95P237X110-3N]
R1103  10k  [RESC1005X04N]
R1104  10k  [RESC1005X04N]
R1105  10k  [RESC1005X04N]
R1107  0R  [RESC1005X04N]
R1108  0R  [RESC1005X04N]
R1110  120R  [RESC3216X06N]
R1111  120R  [RESC3216X06N]
R1112  120R  [RESC3216X06N]
R1113  120R  [RESC3216X06N]
R1114  10k  [RESC1005X04N]
R1115  100R  [RESC1005X04N]
R1116  10k  [RESC1005X04N]
U1101  TCAN1043HDQ1  [TI_D0014A-C01_SOIC-14]

### Ports
CANH (bidir), CANL (bidir), EN (in), FAULT_OD (out), GND, INH, RXD (out), TXD (in), VCC, VIO, VSUP, ~{FAULT} (out), ~{STB} (in)

### Nets
GND: C1103.1 C1104.1 C1105.1 C1106.1 C1107.1 C1108.1 C1109.1 C1110.1 C1111.1 C1112.1 D1102.3 R1114.1 U1101.2(GND) ; port GND
VCC: C1110.2 C1111.2 C1112.2 U1101.3(VCC) ; port VCC
VIO: C1107.2 C1108.2 C1109.2 Q1101.S R1103.2 R1104.2 R1105.2 U1101.5(VIO) ; port VIO
VSUP: C1103.2 C1104.2 C1105.2 R1116.2 U1101.10(VSUP) ; port VSUP
~{FAULT}: R1115.2 U1101.8(~{FAULT}) ; port ~{FAULT}
~{STB}: R1104.1 U1101.14(~{STB}) ; port ~{STB}
CANH: D1102.1 L1100.4 R1110.2 R1111.2 ; port CANH
CANL: D1102.2 L1100.1 R1112.2 R1113.2 ; port CANL
EN: R1103.1 U1101.6(EN) ; port EN
FAULT_OD: Q1101.D R1114.2 ; port FAULT_OD
INH: U1101.7(INH) ; port INH
RXD: R1108.1 ; port RXD
TXD: R1107.1 ; port TXD
NetC1106_2: C1106.2 R1110.1 R1111.1 R1112.1 R1113.1
NetL1100_2: L1100.2 U1101.12(CANL)
NetL1100_3: L1100.3 U1101.13(CANH)
NetQ1101_G: Q1101.G R1115.1
NetR1105_1: R1105.1 R1107.2 U1101.1(TXD)
NetR1108_2: R1108.2 U1101.4(RXD)
NetR1116_1: R1116.1 U1101.9(WAKE)

Not connected (* = marked no-connect by the designer): U1101 11(NC)

### Channels
communication/can/can-transceiver1: designators end in _1; ports CANH=CAN1.H CANL=CAN1.L EN=CAN1-CTRL.EN FAULT_OD=COM_IO.CAN_FAULT GND=GND INH=NetR1101_1 RXD=MCU_CAN1.RX TXD=MCU_CAN1.TX VCC=PER_5.0V VIO=PER_3.3V VSUP=VSUP_30 ~{FAULT}=NetR1115_1_2 ~{STB}=CAN1-CTRL~{.}STB
communication/can/can-transceiver2: designators end in _2; ports CANH=iso_CAN2.H CANL=iso_CAN2.L EN=CAN2.EN_iso FAULT_OD=NetQ1101_2_D GND=GND_ext INH=NetU1101_2_7 RXD=CAN2.RX_iso TXD=CAN2.TX_iso VCC=VISO_ext VIO=VISO_ext VSUP=VISO_ext ~{FAULT}=NetR1115_2_2 ~{STB}=~{CAN2.STB_iso}

### Notes on the sheet
- 4.5V < VSUP < 60V
- (near R1114) open drain fault
- 2.8V < VIO < 5.5V
- 4.5V < VCC < 5.5V
- Fraunhofer IISB
- Schottkystr. 10
- developed by:
- 91058 Erlangen
- Germany
- Author
- Project
- License
- Description
- File
- Version
- Release Date
- Sheet
- foxbms.org <https://foxbms.org>
- www.iisb.fraunhofer.de <https://www.iisb.fraunhofer.de/>
- foxBMS Team
- /

### Library data of the parts
C1103 = gen_C_ceramic_100n_100V_X7R_0603: MLCC; Capacitance: 100n; Rated Voltage: 100V; Dielectric: X7R; Case EIA: 0603; Case Metric: 1608; Automotive Qualified: True; PnP Package: 0603C; Part Number: gen_C_ceramic_100n_100V_X7R_0603; Supplier 1: Digikey; Supplier Part Number 1: 490-13420-1-ND; Supplier 2: Mouser; Supplier Part Number 2: 81-GCJ188R72A104KA1D
C1104 = gen_C_ceramic_1u_100V_X7R_1206: MLCC; Capacitance: 1u; Rated Voltage: 100V; Dielectric: X7R; Case EIA: 1206; Case Metric: 3216; AVT Set: x; Automotive Qualified: True; Part Number: gen_C_ceramic_1u_100V_X7R_1206; Supplier 1: Farnell; Supplier Part Number 1: 1833855
C1105 = gen_C_ceramic_10u_100V_X7S_2220: MLCC; Capacitance: 10u; Rated Voltage: 100V; Dielectric: X7S; Case EIA: 2220; Case Metric: 5750; Automotive Qualified: True; AEC-Q Grade: Grade 0; AEC-Q Norm: AEC-Q200; Part Number: gen_C_ceramic_10u_100V_X7S_2220; Supplier 1: Digikey; Supplier Part Number 1: 445-13152-1-ND; ECCN: EAR99
C1106 = gen_C_ceramic_4n7_50V_X7R_0402: MLCC; Capacitance: 4n7; Rated Voltage: 50V; Dielectric: X7R; Case EIA: 0402; Case Metric: 1005; Automotive Qualified: True; AEC-Q Grade: Grade 1; AEC-Q Norm: AEC-Q200; PnP Package: 0402C; Part Number: gen_C_ceramic_4n7_50V_X7R_0402; ECCN: EAR99; Supplier 1: Digikey; Supplier Part Number 1: 490-14739-1-ND
C1107 C1110 = gen_C_ceramic_10u_16V_X7R_0805: MLCC; Capacitance: 10u; Rated Voltage: 16V; Dielectric: X7S; Case EIA: 0805; Case Metric: 2012; Automotive Qualified: True; AEC-Q Grade: Grade 1; AEC-Q Norm: AEC-Q200; Part Number: gen_C_ceramic_10u_16V_X7R_0805; ECCN: EAR99; Supplier 1: Digikey; Supplier Part Number 1: 445-16110-1-ND
C1108 C1111 = gen_C_ceramic_1u_50V_X7R_0603: MLCC; Capacitance: 1u; Rated Voltage: 50V; Dielectric: X7R; Case EIA: 0603; Case Metric: 1608; Automotive Qualified: False; Tolerance: ± 10%; PnP Package: 0603C; Part Number: gen_C_ceramic_1u_50V_X7R_0603; Operating Temperature: -55°C - +125°C; Supplier 1: Farnell; Supplier Part Number 1: 2779055
C1109 C1112 = gen_C_ceramic_100n_50V_X7R_0402: as C3000 on sheet connectors-internal; Part Number: gen_C_ceramic_100n_50V_X7R_0402; Supplier 1: Farnell; Supplier Part Number 1: 2210822; ECCN: EAR99
D1102 = SM24CANB-02HTG: CAN ESD Protection Diode Array; Manufacturer: Littelfuse; Automotive Qualified: True; Part Number: SM24CANB-02HTG; Part Name: SM24CANB-02HTG; Operating Temperature: -40°C - +125°C; ComponentLink1Description: Datasheet; ComponentLink1URL: https://www.littelfuse.com/~/media/electronics/datasheets/tvs_diode_arrays/littelfuse_tvs_diode_array_sm24canb_datasheet.pdf.pdf; Supplier 1: Digikey; Supplier Part Number 1: F6707CT-ND
L1100 = DLW32SH510XK2L: Common Mode Choke; Manufacturer: Murata; Rated Current: 200mA; Automotive Qualified: True; Part Number: DLW32SH510XK2L; Operating Temperature: –40°C - +125°C; ComponentLink1Description: Datasheet; ComponentLink1URL: https://www.murata.com/en-eu/products/productdata/8799534383134/QFLC9119.pdf?1544104810000; Inductance: 51uH; Supplier 1: Digikey; Supplier Part Number 1: 490-18064-1-ND; Supplier 2: Mouser; Supplier Part Number 2: 81-DLW32SH510XK2L; Supplier 3: Farnell; Supplier Part Number 3: 2871330
Q1101 = DMP10H4D2S-7: MOSFET-Transistor, p-Kanal, 0.27 A, 100 V, 4.2 ohm; Manufacturer: Diodes; Maximum Drain-Source Voltage: 100V; Maximum Continous Drain Current (25°C): 0.27A; R_DS(on): 4.2; Total Gate Charge: 1.8nC; Automotive Qualified: True; Part Number: DMP10H4D2S-7; Part Name: PMOS; Operating Temperature: -55°C - +150°C; ComponentLink1Description: Datasheet; ComponentLink1URL: https://www.diodes.com/assets/Datasheets/DMP10H4D2S.pdf; Supplier 1: Farnell; Supplier Part Number 1: 3127354; Supplier 2: Digikey; Supplier Part Number 2: DMP10H4D2S-7DICT-ND; Supplier 3: Mouser; Supplier Part Number 3: 621-DMP10H4D2S-7
R1103-R1105 R1114 = gen_R_10k_0402: SMD Resistor 10k 0402; Tolerance: 1%; Power: 0.063W; Case EIA: 0402; Case Metric: 1005; Maximum Working Voltage: 50V; PnP Package: 0402R; PnP equipped: x; Automotive Qualified: True; AEC-Q Norm: AEC-Q200; Part Number: gen_R_10k_0402; Operating Temperature: -55°C - +155°C; Resistance: 10k; Series: E24, E96; PnP Value: 10k; Supplier 1: Farnell; Supplier Part Number 1: 2059239; ECCN: EAR99
R1107 R1108 = gen_R_0R_0402: as R1101 on sheet can; Part Number: gen_R_0R_0402; Operating Temperature: -55°C - +155°C; Resistance: 0R; Series: Jumper; PnP Value: 0R; Supplier 1: Farnell; Supplier Part Number 1: 1469661; Supplier 2: Farnell; Supplier Part Number 2: 2059190; ECCN: EAR99
R1110-R1113 = gen_R_120R_1206: SMD Resistor 120R 1206; Tolerance: 1%; Power: 0.3W; Case EIA: 1206; Case Metric: 3216; Maximum Working Voltage: 200V; PnP Package: 1206R; Automotive Qualified: True; AEC-Q Grade: Grade 0; AEC-Q Norm: AEC-Q200; Part Number: gen_R_120R_1206; Operating Temperature: -55°C - +155°C; Resistance: 120R; Series: E24; PnP Value: 120R; ECCN: EAR99; Supplier 1: Digikey; Supplier Part Number 1: A129799CT-ND
R1115 = gen_R_100R_0402: SMD Resistor 100R 0402; Tolerance: 1%; Power: 0.063W; Case EIA: 0402; Case Metric: 1005; Maximum Working Voltage: 50V; PnP Package: 0402R; PnP equipped: x; Automotive Qualified: True; AEC-Q Norm: AEC-Q200; Part Number: gen_R_100R_0402; Operating Temperature: -55°C - +155°C; Resistance: 100R; Series: E24, E96; PnP Value: 100R; Supplier 1: Farnell; Supplier Part Number 1: 2302528; ECCN: EAR99
R1116 = gen_R_10k_0402: SMD Resistor 10k 0402; Tolerance: 1%; Power: 0.063W; Case EIA: 0402; Case Metric: 1005; Maximum Working Voltage: 50V; PnP Package: 0402R; Automotive Qualified: True; PnP equipped: x; AEC-Q Norm: AEC-Q200; Part Number: gen_R_10k_0402; Operating Temperature: -55°C - +155°C; Resistance: 10k; Series: E24, E96; PnP Value: 10k; Supplier 1: Farnell; Supplier Part Number 1: 2059239; ECCN: EAR99
U1101 = TCAN1043HDQ1: Low-Power Fault Protected CAN Transceiver with CAN FD and Wake; Manufacturer: Texas Instruments; PnP Package: SOIC-14; Automotive Qualified: True; AEC-Q Norm: AEC-Q100; AEC-Q Grade: Grade 1; Part Number: TCAN1043HDQ1; Part Name: TCAN1043HDQ1; Operating Temperature: −55°C - +125°C; ComponentLink1Description: Datasheet; ComponentLink1URL: https://www.ti.com/lit/ds/symlink/tcan1043h-q1.pdf?HQS=dis-mous-null-mousermode-dsf-pf-null-wwe&DCM=yes&ref_url=https%3A%2F%2Fwww.mouser.de%2F&distId=26; Supplier 1: Mouser; Supplier Part Number 1: 595-TCAN1043HDQ1; Supplier 2: Digikey; Supplier Part Number 2: 296-47920-ND; ECCN: EAR99

## Sheet digital-isolator-3in-1out-power.SchDoc
size A3; DocumentNumber: 5; SheetNumber: 5; SheetTotal: 45; SheetDescription: Digital Isolator 3x in / 1x out with power
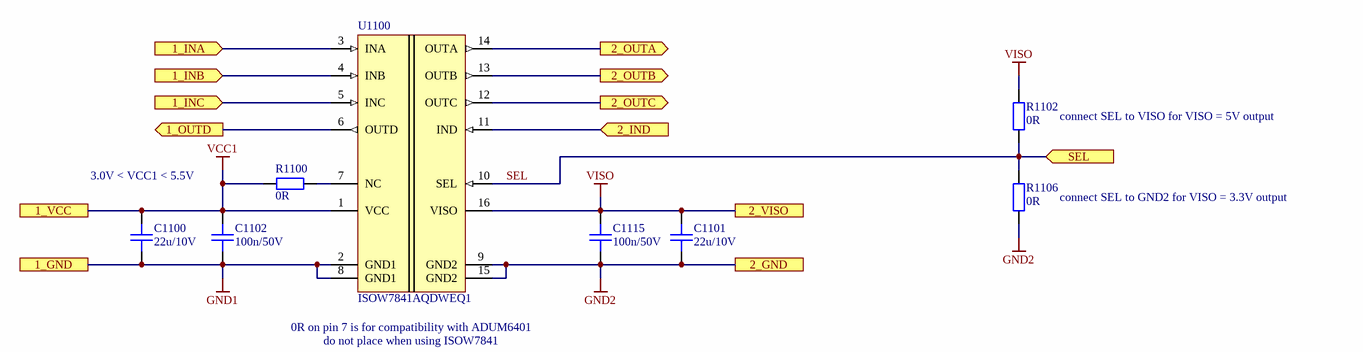
[diagram p12: digital-isolator-3in-1out-power.SchDoc]

### Parts
C1100  22u/10V  [CAPC3216X18N]
C1101  22u/10V  [CAPC3216X18N]
C1102  100n/50V  [CAPC1005X06N]
C1115  100n/50V  [CAPC1005X06N]
R1100  0R  [RESC1005X04N]
R1102  0R  [RESC1005X04N]
R1106  0R  [RESC1005X04N]
U1100  ISOW7841AQDWEQ1  [TI_DWE0016A]

### Ports
1_GND, 1_INA (in), 1_INB (in), 1_INC (in), 1_OUTD (out), 1_VCC, 2_GND, 2_IND (in), 2_OUTA (out), 2_OUTB (out), 2_OUTC (out), 2_VISO, SEL (in)

### Nets
GND1: C1100.1 C1102.1 U1100.2(GND1) U1100.8(GND1) ; port 1_GND  [project net GND]
GND2: C1101.1 C1115.1 R1106.1 U1100.9(GND2) U1100.15(GND2) ; port 2_GND  [project net GND_ext]
VCC1: C1100.2 C1102.2 R1100.2 U1100.1(VCC) ; port 1_VCC  [project net PER_3.3V]
VISO: C1101.2 C1115.2 R1102.2 U1100.16(VISO) ; port 2_VISO  [project net VISO_ext]
~{CAN2.STB_iso}: U1100.12(OUTC) ; port 2_OUTC
CAN2-CTRL~{.}STB: U1100.5(INC) ; port 1_INC
CAN2-CTRL.EN: U1100.4(INB) ; port 1_INB
CAN2.EN_iso: U1100.13(OUTB) ; port 2_OUTB
CAN2.RX_iso: U1100.11(IND) ; port 2_IND
CAN2.TX_iso: U1100.14(OUTA) ; port 2_OUTA
MCU_CAN2.RX: U1100.6(OUTD) ; port 1_OUTD
MCU_CAN2.TX: U1100.3(INA) ; port 1_INA
SEL: R1102.1 R1106.2 U1100.10(SEL) ; port SEL
NetR1100_1: R1100.1 U1100.7(NC)

### Notes on the sheet
- (near R1102) connect SEL to VISO for VISO = 5V output
- 3.0V < VCC1 < 5.5V
- (near R1106) connect SEL to GND2 for VISO = 3.3V output
- (near U1100) 0R on pin 7 is for compatibility with ADUM6401
- do not place when using ISOW7841
- Fraunhofer IISB
- Schottkystr. 10
- developed by:
- 91058 Erlangen
- Germany
- Author
- Project
- License
- Description
- File
- Version
- Release Date
- Sheet
- foxbms.org <https://foxbms.org>
- www.iisb.fraunhofer.de <https://www.iisb.fraunhofer.de/>
- foxBMS Team
- /

### Library data of the parts
C1100 C1101 = gen_C_ceramic_22u_10V_X7R_1206: MLCC; Capacitance: 22u; Rated Voltage: 10V; Dielectric: X7R; Case EIA: 1206; Case Metric: 3216; Automotive Qualified: True; Part Number: gen_C_ceramic_22u_10V_X7R_1206; Supplier 1: Digikey; Supplier Part Number 1: 587-4243-1-ND
C1102 C1115 = gen_C_ceramic_100n_50V_X7R_0402: as C3000 on sheet connectors-internal; Part Number: gen_C_ceramic_100n_50V_X7R_0402; Supplier 1: Farnell; Supplier Part Number 1: 2210822; ECCN: EAR99
R1100 = gen_R_0R_0402: SMD Resistor 0R 0402; Power: 0.063W; Case EIA: 0402; Case Metric: 1005; Maximum Working Voltage: 50V; PnP Package: 0402R; Automotive Qualified: True; PnP equipped: x; AEC-Q Norm: AEC-Q200; Part Number: gen_R_0R_0402; Operating Temperature: -55°C - +155°C; Resistance: 0R; Series: Jumper; PnP Value: 0R; Supplier 1: Farnell; Supplier Part Number 1: 1469661; Supplier 2: Farnell; Supplier Part Number 2: 2059190; ECCN: EAR99
R1102 R1106 = gen_R_0R_0402: as R1101 on sheet can; Part Number: gen_R_0R_0402; Operating Temperature: -55°C - +155°C; Resistance: 0R; Series: Jumper; PnP Value: 0R; Supplier 1: Farnell; Supplier Part Number 1: 1469661; Supplier 2: Farnell; Supplier Part Number 2: 2059190; ECCN: EAR99
U1100 = ISOW7841AQDWEQ1: Automotive High-Performance, 5000-VRMS Reinforced Quad-Channel Digital Isolator With Integrated High-Efficiency, Low-Emissions DC-DC Converter; Manufacturer: Texas Instruments; PnP Package: SOIC-16; Automotive Qualified: True; AEC-Q Norm: AEC-Q100; AEC-Q Grade: Grade 1; Part Number: ISOW7841AQDWEQ1; Part Name: ISOW7841AQDWEQ1; Operating Temperature: −40°C - +125°C; ComponentLink1Description: Datasheet; ComponentLink1URL: https://www.ti.com/lit/ds/symlink/isow7841a-q1.pdf?ts=1619516874236; Supplier 1: Digikey; Supplier Part Number 1: 296-ISOW7841AQDWEQ1-ND; Supplier 2: Mouser; Supplier Part Number 2: 595-ISOW7841AQDWEQ1; ECCN: EAR99

## Sheet ethernet.SchDoc
size A3; DocumentNumber: 6; SheetNumber: 6; SheetTotal: 45; SheetDescription: Ethernet Communication
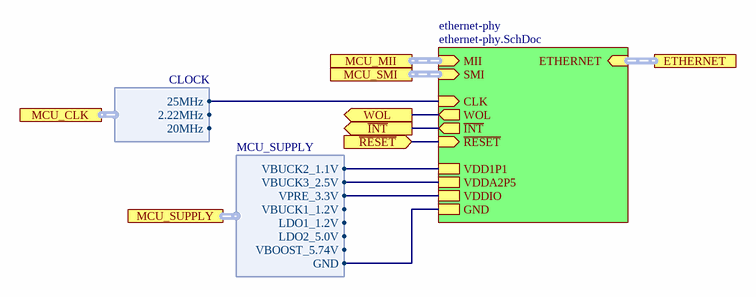
[diagram p13: ethernet.SchDoc]

### Sub-sheets
ethernet-phy = ethernet-phy.SchDoc: ~{RESET} (in), WOL (out), CLK (in), ~{INT} (out), GND, VDDA2P5, VDD1P1, VDDIO, ETHERNET (in, harness ETHERNET), MII (in, harness MCU_MII), SMI (in, harness MCU_SMI)

### Ports
ETHERNET (harness ETHERNET), MCU_CLK (harness CLOCK), MCU_MII (harness MCU_MII), MCU_SMI (harness MCU_SMI), MCU_SUPPLY (harness MCU_SUPPLY), WOL (out), ~{INT} (out), ~{RESET} (in)

### Harnesses
CLOCK: 2.22MHz, 20MHz, 25MHz
MCU_SUPPLY: VBUCK1_1.2V, VBUCK2_1.1V, VBUCK3_2.5V, LDO1_1.2V, LDO2_5.0V, GND, VPRE_3.3V, VBOOST_5.74V

### Nets
GND: sheet ethernet-phy/GND, port MCU_SUPPLY.GND
MCU_1.1V: sheet ethernet-phy/VDD1P1, port MCU_SUPPLY.VBUCK2_1.1V
MCU_2.5V: sheet ethernet-phy/VDDA2P5, port MCU_SUPPLY.VBUCK3_2.5V
MCU_3.3V: sheet ethernet-phy/VDDIO, port MCU_SUPPLY.VPRE_3.3V
COM_IO~{.}ETH_INT: port ~{INT}, sheet ethernet-phy/~{INT}
COM_IO_PE.IO1_2: port ~{RESET}, sheet ethernet-phy/~{RESET}
MCU_CLK.25MHz: sheet ethernet-phy/CLK, port MCU_CLK.25MHz
NetU1200_22: port WOL, sheet ethernet-phy/WOL

### Buses and harness runs
harness port ETHERNET = sheet ethernet-phy/ETHERNET
harness port MCU_MII = sheet ethernet-phy/MII
harness port MCU_SMI = sheet ethernet-phy/SMI

### Notes on the sheet
- Fraunhofer IISB
- Schottkystr. 10
- developed by:
- 91058 Erlangen
- Germany
- Author
- Project
- License
- Description
- File
- Version
- Release Date
- Sheet
- foxbms.org <https://foxbms.org>
- www.iisb.fraunhofer.de <https://www.iisb.fraunhofer.de/>
- foxBMS Team
- /